# Altium schematic sheet Micro Control Unit.SchDoc
size B
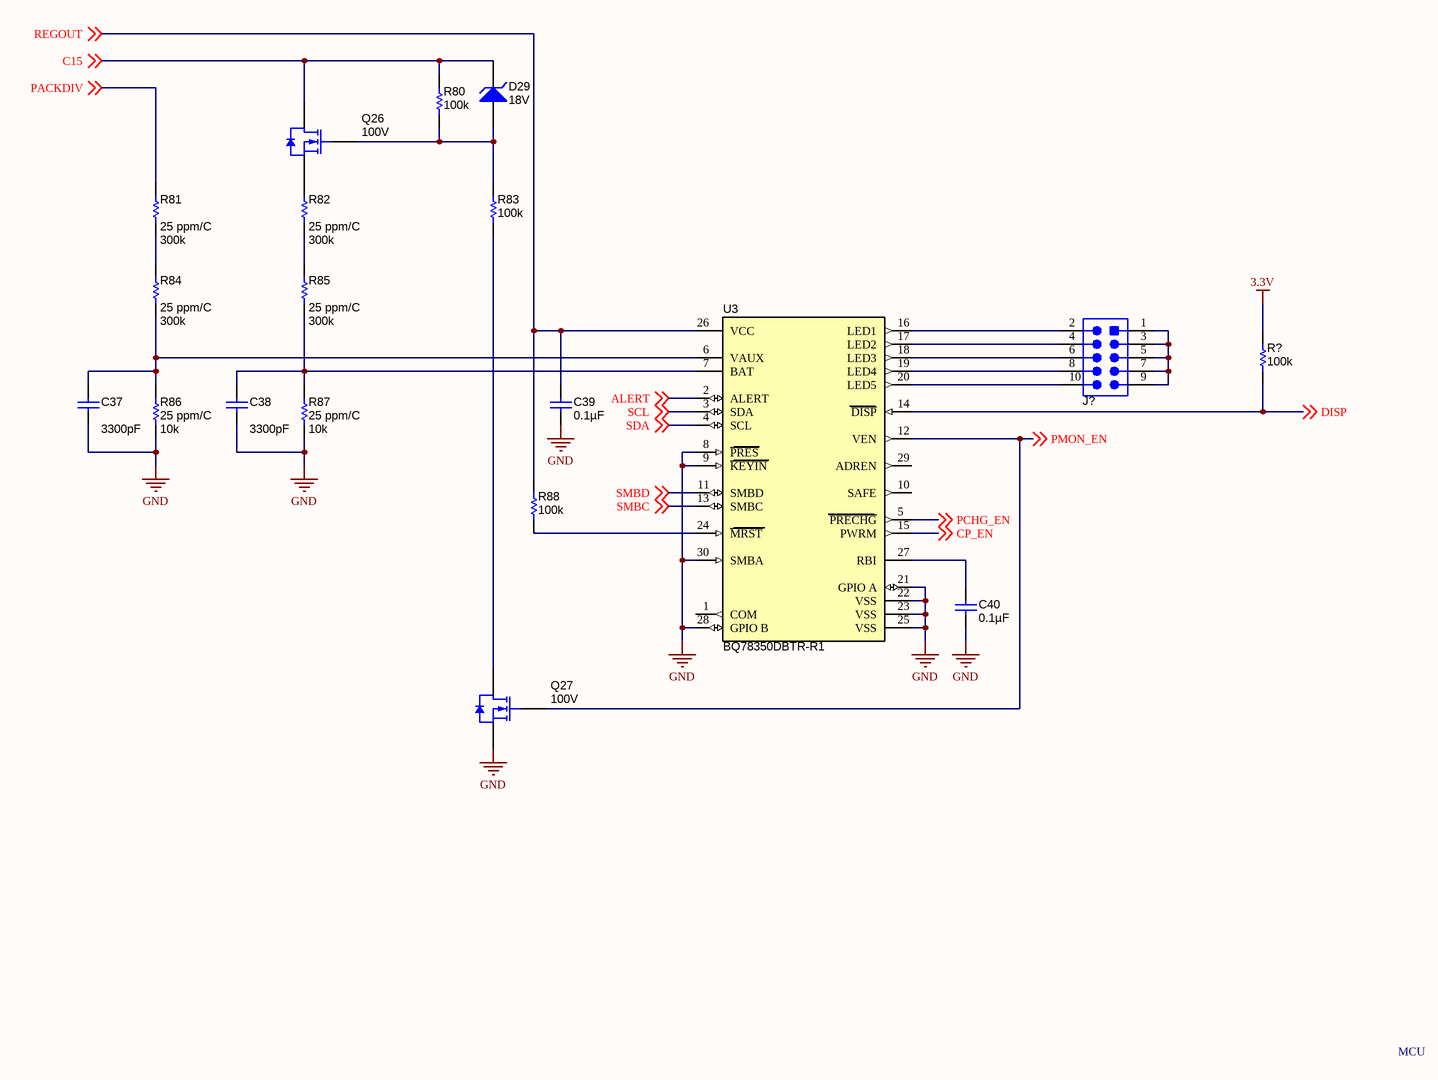
[diagram p0: Micro Control Unit.SchDoc]

## Parts
C37  ValueDisplayed: 3300pF  [CAP 0603/1608]  (hidden comment: GRM188R71E332KA01D)
C38  ValueDisplayed: 3300pF  [CAP 0603/1608]  (hidden comment: GRM188R71E332KA01D)
C39  ValueDisplayed: 0.1µF  [CAP 0603/1608]  (hidden comment: C1608X7R1H104K080AA)
C40  ValueDisplayed: 0.1µF  [CAP 0603/1608]  (hidden comment: C1608X7R1H104K080AA)
D29  value 18V  [SOD323F]  (hidden comment: MM3Z18VB)
J?  S10B-PHDSS(LF)(SN)  [JST S10B-PHDSS]  (value not drawn)
Q26  value 100V  [SOT323]  (hidden comment: BSS123WQ-7-FDICT-ND)
Q27  value 100V  [SOT323]  (hidden comment: BSS123WQ-7-FDICT-ND)
R80  ValueDisplayed: 100k  [RES 0603/1608]  (hidden comment: RCA0603100KJNEA)
R81  TempCo: 25 ppm/C  ValueDisplayed: 300k  [RES 0603/1608]  (hidden comment: ERA-3AEB103V)
R82  TempCo: 25 ppm/C  ValueDisplayed: 300k  [RES 0603/1608]  (hidden comment: ERA-3AEB103V)
R83  ValueDisplayed: 100k  [RES 0603/1608]  (hidden comment: RCA0603100KJNEA)
R84  TempCo: 25 ppm/C  ValueDisplayed: 300k  [RES 0603/1608]  (hidden comment: ERA-3AEB103V)
R85  TempCo: 25 ppm/C  ValueDisplayed: 300k  [RES 0603/1608]  (hidden comment: ERA-3AEB103V)
R86  TempCo: 25 ppm/C  ValueDisplayed: 10k  [RES 0603/1608]  (hidden comment: ERA-3AEB103V)
R87  TempCo: 25 ppm/C  ValueDisplayed: 10k  [RES 0603/1608]  (hidden comment: ERA-3AEB103V)
R88  ValueDisplayed: 100k  [RES 0603/1608]  (hidden comment: RCA0603100KJNEA)
R?  ValueDisplayed: 100k  [RES 0603/1608]  (hidden comment: RCA0603100KJNEA)
U3  BQ78350DBTR-R1  [TTSOP30_N V2]

## Nets
3.3V: R?.2
GND: C37.1 C38.1 C39.2 C40.2 Q27.2(S) R86.1 R87.1 U3.8(~{PRES}) U3.9(~{KEYIN}) U3.21(GPIO_A) U3.22(VSS) U3.23(VSS) U3.25(VSS) U3.28(GPIO_B) U3.30(SMBA)
ALERT: U3.2(ALERT) ; off-sheet ALERT
C15: D29.1(K) Q26.3(D) R80.2 ; off-sheet C15
CP_EN: U3.15(PWRM) ; off-sheet CP_EN
DISP: R?.1 U3.14(~{DISP}) ; off-sheet DISP
PACKDIV: R81.2 ; off-sheet PACKDIV
PCHG_EN: U3.5(~{PRECHG}) ; off-sheet PCHG_EN
PMON_EN: Q27.1(G) U3.12(VEN) ; off-sheet PMON_EN
REGOUT: C39.1 R88.2 U3.26(VCC) ; off-sheet REGOUT
SCL: U3.3(SDA) ; off-sheet SCL
SDA: U3.4(SCL) ; off-sheet SDA
SMBC: U3.13(SMBC) ; off-sheet SMBC
SMBD: U3.11(SMBD) ; off-sheet SMBD
NetC37_2: C37.2 R84.1 R86.2 U3.6(VAUX)
NetC38_2: C38.2 R85.1 R87.2 U3.7(BAT)
NetC40_1: C40.1 U3.27(RBI)
NetD29_2: D29.2(A) Q26.1(G) R80.1 R83.2
NetJ?_1: J?.1 J?.3 J?.5 J?.7 J?.9
NetQ26_2: Q26.2(S) R82.2
NetQ27_3: Q27.3(D) R83.1
NetR81_1: R81.1 R84.2
NetR82_1: R82.1 R85.2
NetR88_1: R88.1 U3.24(~{MRST})

Not connected (* = marked no-connect by the designer): J? 2 4 6 8 10; U3 1(COM) 10(SAFE) 16(LED1) 17(LED2) 18(LED3) 19(LED4) 20(LED5) 29(ADREN)

## Notes on the sheet
- MCU

## Library data of the parts
C37 C38 = GRM188R71E332KA01D: CAP, CERM, 3300pF, 25V, +/-10%, X7R, 0603; Manufacturer: MuRata; Polarized: N; CompType: Capacitor; U/M: EA; Cap_F: 0.0000000033; Tolerance_%: 10; Value1: Unknown; VDC_V: 25; TaMin_C: -55; TaMax_C: 125; Cap_Case: 0603; SymbolVersion: 2008-07-09; Value: 3300pF; PartNumber: GRM188R71E332KA01D; PackageReference: 0603; RoHS: Y; Value2: 25V; MountType: SMT; Technology: Ceramic; TempCo: X7R; Published: 2008-06-19; Publisher: Texas Instruments; LatestRevisionDate: 2013-10-27; ComponentLink1Description: Datasheet link; ComponentLink1URL: http://search.murata.co.jp/Ceramy/PnsearchViewAction.do?HnOFG=ON&HnNFG=ON&SEL_CNT=50&sLang=en&sKey=GRM188R71E332KA01D&x=9&y=9&search=startwith; Supplier 1: Digi-Key; Supplier Part Number 1: GRM188R71E332KA01D-ND; Supplier 2: Mouser; Supplier Part Number 2: 81-GRM18R71E332KA01D
C39 C40 = C1608X7R1H104K080AA: CAP, CERM, 0.1 µF, 50 V, +/- 10%, X7R, 0603; Manufacturer: TDK; Polarized: N; CompType: Capacitor; Value: 0.1uF; U/M: EA; Cap_F: 0.0000001; Tolerance_%: 10; ESR_ohm: 0.0296; Value1: 0.0296 ohm; VDC_V: 50; Value2: 50V; IRMS_A: 0.97199; TaMin_C: -55; TaMax_C: 125; Cap_Case: 0603; SizeArea_mm2: 1.28; SizeAreaWB_mm2: 4.68; SizeX_mm: 1.6; SizeY_mm: 0.8; SizeZ_mm: 1; AEC Category: Q200; SymbolVersion: 2008-07-09; PartNumber: C1608X7R1H104K080AA; PackageReference: 0603; RoHS: Y; MountType: SMT; Technology: Ceramic; TempCo: X7R; Published: 2008-06-19; Publisher: Texas Instruments; LatestRevisionDate: 2016-06-14; ComponentLink1Description: Datasheet link; ComponentLink1URL: https://product.tdk.com/en/search/capacitor/ceramic/mlcc/info?part_no=C1608X7R1H104K080AA; AEC Qualified: N; AEC Grade: N/A; Supplier 1: Digi-Key; Supplier 2: Mouser; Supplier Part Number 1: 445-1314-6-ND; Supplier Part Number 2: 810-C1608X7R1H104K
D29 = MM3Z18VB: DIODE ZENER 18V 200MW SOD323F; Manufacturer: Fairchild/ON Semiconductor; U/M: EA; Power_W: 0.2; Vz_V: 18; Value1: 0.2W; RJA_CperW: 350; SymbolCreator: a0412235; AEC Category: Q101; CompType: Zener; SymbolVersion: 2010-08-25; PartNumber: MM3Z18VB; PackageReference: SOD-323F; Vr_V: N/A; MountType: SMT; RoHS: Y; ComponentLink1Description: Datasheet link; ComponentLink1URL: https://www.fairchildsemi.com/datasheets/MM/MM3Z10VB.pdf; Published: 2008-10-08; Publisher: Texas Instruments; LatestRevisionDate: 2016-04-07; LatestRevisionNote: Updated Supplier Data; AEC Qualified: ?; Supplier 1: Digi-Key; Supplier 2: Newark; Supplier 3: Mouser; Supplier Part Number 1: MM3Z18VBDKR-ND; Supplier Part Number 2: 52M5724; Supplier Part Number 3: 512-MM3Z18VB
J? = S10B-PHDSS(LF)(SN): CONN HEADER PHD SIDE 10POS 2ROW 2MM; Manufacturer: JST Sales America Inc.; CompType: Terminal Block; U/M: EA; SymbolVersion: 2013-12-22; PartNumber: S10B-PHDSS(LF)(SN); PackageReference: 11.9x9.5x5.0 mm; RoHS: Y; MountType: TH; ComponentLink1Description: Datasheet Link; ComponentLink1URL: http://www.jst-mfg.com/product/pdf/eng/ePHD.pdf; Publisher: Texas Instruments; LatestRevisionDate: 2015-02-18; Supplier 1: Digi-Key; Supplier Part Number 1: 455-1775-ND
Q26 Q27 = BSS123WQ-7-FDICT-ND: MOSFET N-CH 100V 0.17A SOT323; Manufacturer: Diodes Incorporated; Alternate Manufacturer: None; U/M: EA; ChType: N; VdsMax_V: 100; Value1: 6 ohm; Rdson45_Ohm: 10; Vgs_V: 20; IdsMax_A: 0.17; SymbolVersion: 2008-07-28; CompType: MOSFET; PartNumber: BSS123WQ-7-FDICT-ND; PackageReference: SOT-323; RoHS: Y; MountType: SMT; Published: 2008-06-19; Publisher: Texas Instruments; LatestRevisionDate: 2013-10-21; LatestRevisionNote: Added parts.; ComponentLink1Description: Datasheet link; ComponentLink1URL: https://www.diodes.com/assets/Datasheets/BSS123WQ.pdf; Supplier 1: Digi-Key; Supplier Part Number 1: BSS123WQ-7-FDICT-ND
R80 R83 R88 R? = RCA0603100KJNEA: RES SMD 100K OHM 5% 1/10W 0603; Manufacturer: Vishay-Dale; CompType: Resistor; Res_ohm: 100000; Tolerance_%: 5; Power_W: 0.1; Value2: 0.1W; VDC_V: 75; TempCo: 200 ppm/C; EIA_Code: E24; U/M: EA; AEC Category: Q200; SymbolVersion: 2009-05-29; Value: 100k; PartNumber: RCA0603100KJNEA; PackageReference: 0603; RoHS: Y; Value_Code: 100k; Value1: 5%; MountType: SMT; Technology: Thick Film; Published: 2008-06-26; Publisher: Texas Instruments; LatestRevisionDate: 2016-04-07; ComponentLink1Description: Datasheet link; ComponentLink1URL: http://www.vishay.com/docs/20037/rcae3.pdf; AEC Qualified: ?; Supplier 1: Digi-Key; Supplier Part Number 1: 541-2215-6-ND
R81 R82 R84 R85 = ERA-3AEB304V: RES SMD 300K OHM 0.1% 1/10W 0603; Manufacturer: Panasonic Electronic Components; CompType: Resistor; Res_ohm: 300000; Value_Code: 10k0; Tolerance_%: .1; Value1: .1%; Power_W: 0.1; Value2: 0.1W; VDC_V: 75; EIA_Code: E24; U/M: EA; SymbolVersion: 2009-05-29; Value: 300k; PartNumber: ERA-3AEB103V; PackageReference: 0603; RoHS: Y; MountType: SMT; Technology: Thick Film; Published: 2008-06-26; Publisher: Texas Instruments; LatestRevisionDate: 2015-04-06; ComponentLink1Description: Datasheet link; ComponentLink1URL: https://www.digikey.com/catalog/en/partgroup/era-3a-series/5907?mpart=ERA-3AEB103V&vendor=10; Supplier 1: Mouser; Supplier 2: Digi-Key; Supplier Part Number 1: 667-ERA-3AEB103V; Supplier Part Number 2: P10KDBDKR-ND
R86 R87 = ERA-3AEB103V: RES SMD 10K OHM 0.1% 1/10W 0603; Manufacturer: Panasonic Electronic Components; CompType: Resistor; Res_ohm: 10000; Value_Code: 10k0; Tolerance_%: .1; Value1: .1%; Power_W: 0.1; Value2: 0.1W; VDC_V: 75; EIA_Code: E24; U/M: EA; SymbolVersion: 2009-05-29; Value: 10k; PartNumber: ERA-3AEB103V; PackageReference: 0603; RoHS: Y; MountType: SMT; Technology: Thick Film; Published: 2008-06-26; Publisher: Texas Instruments; LatestRevisionDate: 2015-04-06; ComponentLink1Description: Datasheet link; ComponentLink1URL: https://www.digikey.com/catalog/en/partgroup/era-3a-series/5907?mpart=ERA-3AEB103V&vendor=10; Supplier 1: Mouser; Supplier 2: Digi-Key; Supplier Part Number 1: 667-ERA-3AEB103V; Supplier Part Number 2: P10KDBDKR-ND
U3 = BQ78350DBTR-R1: CEDV Li-Ion Gas Gauge and Battery Management Controller Companion to the bq769x0 Battery Monitoring AFE, DBT0030A; Alternate PartNumber: BQ78350DBT-R1; Manufacturer: Texas Instruments; SymbolCreator: x0208325; CompType: IC; U/M: EA; SymbolVersion: 2013-11-18; PartNumber: BQ78350DBTR-R1; PackageReference: DBT0030A; MountType: SMT; ComponentLink1Description: Datasheet Link; ComponentLink1URL: http://www.ti.com/lit/ds/symlink/bq78350-r1.pdf; RoHS: Y; Publisher: Texas Instruments; LatestRevisionDate: 2016-04-08; Alternate Manufacturer: Texas Instruments